# Altium schematic sheet LoRaGN.SchDoc
size 420 x 297 mm; SheetNumber: 1; SheetTotal: 1
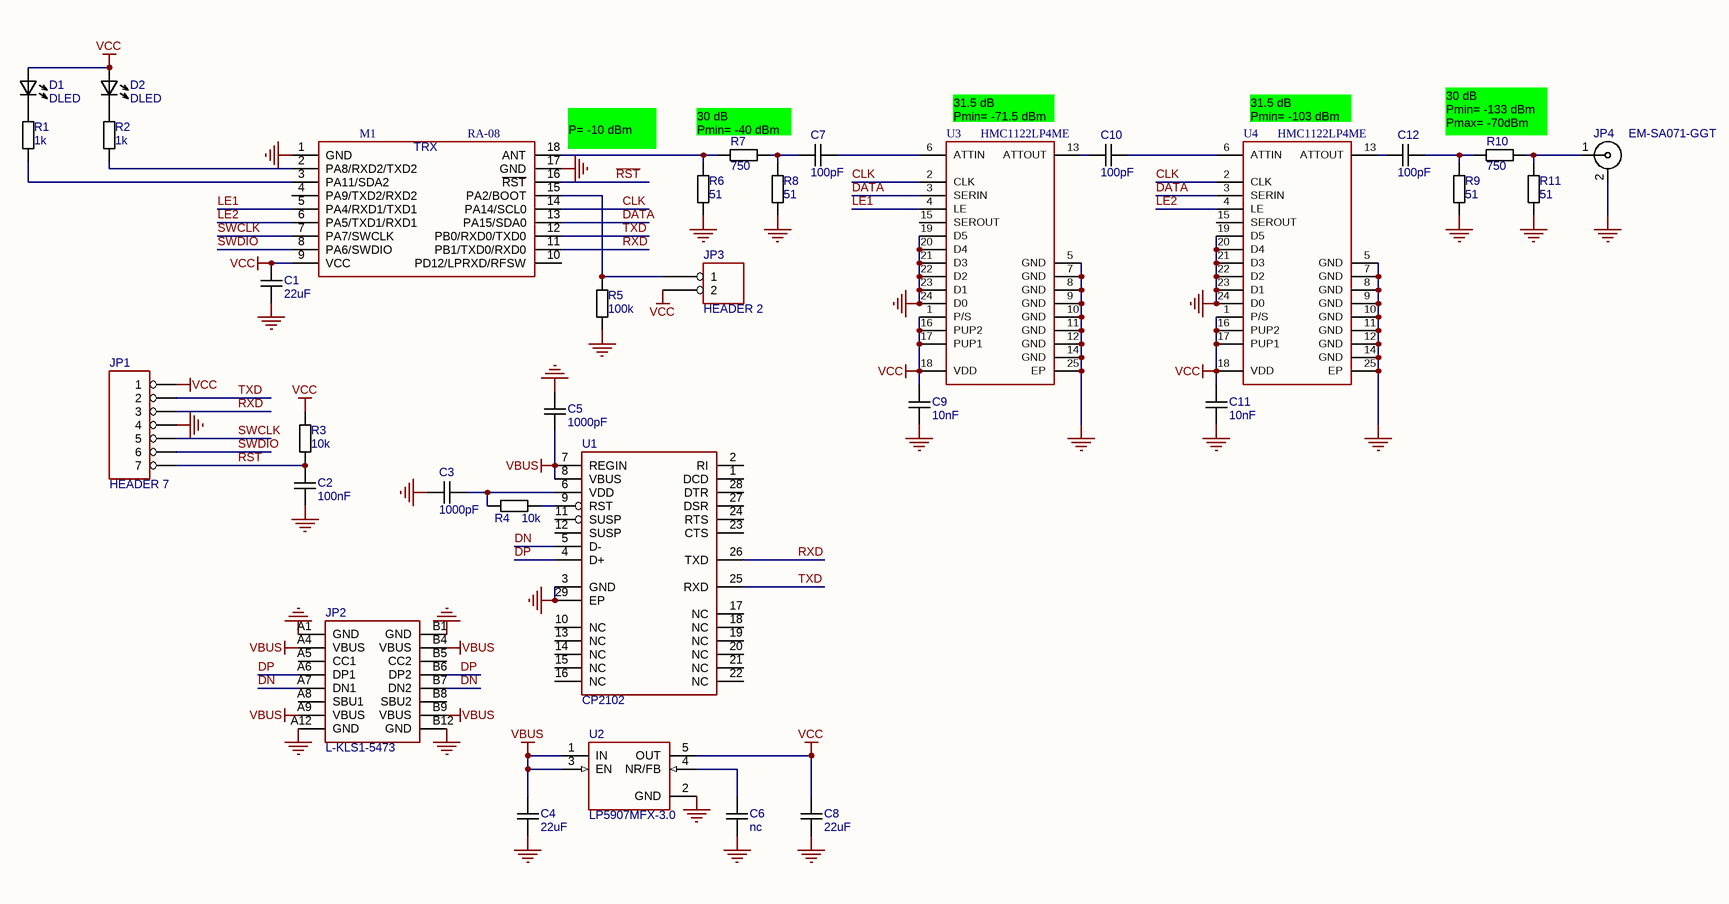
[diagram p0: LoRaGN.SchDoc]

## Parts
C1  22uF  [C-0805]
C2  100nF  [C-0603]
C3  1000pF  [C-0603]
C4  22uF  [C-0805]
C5  1000pF  [C-0603]
C6  nc  [C-0603]
C7  100pF  [C-0603]
C8  22uF  [C-0805]
C9  10nF  [C-0603]
C10  100pF  [C-0603]
C11  10nF  [C-0603]
C12  100pF  [C-0603]
D1  DLED  [LED0805]
D2  DLED  [LED0805]
JP1  HEADER 7  [PLS1-7]
JP2  L-KLS1-5473  [L-KLS1-5473]
JP3  HEADER 2  [PLS1-2]
JP4  EM-SA071-GGT  [SMA_F_EDGE]
M1  RA-08  [LGA18_RA08]
R1  1k  [R-0603]
R2  1k  [R-0603]
R3  10k  [R-0603]
R4  10k  [R-0603]
R5  100k  [R-0603]
R6  51  [R-0603]
R7  750  [R-0603]
R8  51  [R-0603]
R9  51  [R-0603]
R10  750  [R-0603]
R11  51  [R-0603]
U1  CP2102  [QFN28]
U2  LP5907MFX-3.0  [SOT-23-5]
U3  HMC1122LP4ME  [QFN-24(4X4)]
U4  HMC1122LP4ME  [QFN-24(4X4)]

## Nets
GND: C1.1 C2.1 C3.2 C4.2 C5.1 C6.2 C8.2 C9.1 C11.1 JP1.4 JP2.A1(GND) JP2.A12(GND) JP2.B1(GND) JP2.B12(GND) JP4.2 M1.1(GND) M1.17(GND) R5.1 R6.1 R8.1 R9.1 R11.1 U1.3(GND) U1.29(EP) U2.2(GND) U3.5(GND) U3.7(GND) U3.8(GND) U3.9(GND) U3.10(GND) U3.11(GND) U3.12(GND) U3.14(GND) U3.19(D5) U3.20(D4) U3.21(D3) U3.22(D2) U3.23(D1) U3.24(D0) U3.25(EP) U4.5(GND) U4.7(GND) U4.8(GND) U4.9(GND) U4.10(GND) U4.11(GND) U4.12(GND) U4.14(GND) U4.19(D5) U4.20(D4) U4.21(D3) U4.22(D2) U4.23(D1) U4.24(D0) U4.25(EP)
VBUS: C4.1 C5.2 JP2.A4(VBUS) JP2.A9(VBUS) JP2.B4(VBUS) JP2.B9(VBUS) U1.7(REGIN) U1.8(VBUS) U2.1(IN) U2.3(EN)
VCC: C1.2 C8.1 C9.2 C11.2 D1.1 D2.1 JP1.1 JP3.2 M1.9(VCC) R3.2 U2.5(OUT) U3.1(P/S) U3.16(PUP2) U3.17(PUP1) U3.18(VDD) U4.1(P/S) U4.16(PUP2) U4.17(PUP1) U4.18(VDD)
CLK: M1.14(PA14/SCL0) U3.2(CLK) U4.2(CLK)
DATA: M1.13(PA15/SDA0) U3.3(SERIN) U4.3(SERIN)
DN: JP2.A7(DN1) JP2.B7(DN2) U1.5(D-)
DP: JP2.A6(DP1) JP2.B6(DP2) U1.4(D+)
LE1: M1.5(PA4/RXD1/TXD1) U3.4(LE)
LE2: M1.6(PA5/TXD1/RXD1) U4.4(LE)
~{RST}: C2.2 JP1.7 M1.16(~{RST}) R3.1
RXD: JP1.3 M1.11(PB1/TXD0/RXD0) U1.26(TXD)
SWCLK: JP1.5 M1.7(PA7/SWCLK)
SWDIO: JP1.6 M1.8(PA6/SWDIO)
TXD: JP1.2 M1.12(PB0/RXD0/TXD0) U1.25(RXD)
NetC3_1: C3.1 R4.2 U1.6(VDD)
NetC6_1: C6.1 U2.4(NR/FB)
NetC7_1: C7.1 R7.2 R8.2
NetC7_2: C7.2 U3.6(ATTIN)
NetC10_1: C10.1 U3.13(ATTOUT)
NetC10_2: C10.2 U4.6(ATTIN)
NetC12_1: C12.1 U4.13(ATTOUT)
NetC12_2: C12.2 R9.2 R10.1
NetD1_2: D1.2 R1.2
NetD2_2: D2.2 R2.2
NetJP3_1: JP3.1 M1.15(PA2/BOOT) R5.2
NetJP4_1: JP4.1 R10.2 R11.2
NetM1_2: M1.2(PA8/RXD2/TXD2) R2.1
NetM1_3: M1.3(PA11/SDA2) R1.1
NetM1_18: M1.18(ANT) R6.2 R7.1
NetR4_1: R4.1 U1.9(RST)

Not connected (* = marked no-connect by the designer): JP2 17(VSS) A5(CC1) A8(SBU1) B5(CC2) B8(SBU2); M1 4(PA9/TXD2/RXD2) 10(PD12/LPRXD/RFSW); U1 1(DCD) 2(RI) 10(NC) 11(SUSP) 12(SUSP) 13(NC) 14(NC) 15(NC) 16(NC) 17(NC) 18(NC) 19(NC) 20(NC) 21(NC) 22(NC) 23(CTS) 24(RTS) 27(DSR) 28(DTR); U3 15(SEROUT); U4 15(SEROUT)

## Notes on the sheet
- 30 dB
  Pmin= -40 dBm
- (near U3) 31.5 dB
  Pmin= -71.5 dBm
- (near U4) 31.5 dB
  Pmin= -103 dBm
- (near R10) 30 dB
  Pmin= -133 dBm
  Pmax= -70dBm
- P= -10 dBm
- Перв. заст.
- Довідк. №
- Підп. і дата
- Інв. № дубл.
- Зам. інв. №
- Зм.
- Арк.
- № докум.
- Підп.
- Дата
- Літ.
- Маса
- Масштаб
- Т.контр.
- Перев.
- Розроб.
- Аркуш
- Аркушів
- Інв. № ориг.
- Н.контр.
- Затв.
- Копіював
- Формат А3
- (in symbol RA-08) TRX

## Library data of the parts
C1-C12 = CAPN: Voltage: 50V; Точність/група: NP0; Вид: Конденсатор
D1 D2 = DLED: Вид: Світлодіод
JP1 = HEADER 7: Вид: Роз'єм; *: *
JP2 = L-KLS1-5473: Mounting  Method: SMD; Value: *
JP3 = HEADER 2: Вид: Роз'єм; *: *
JP4 = SMA: SMA Female R/A PCB Mount; Вид: Роз'єм
R1-R11 = RES: Точність/група: 5%; Вид: Резистор
U1 = CP2102: Value: {Value}; Mounting  Method: SMD
U2 = LP5907: 250mA Low-Dropout Regulator; Вид: Мікросхема
U3 U4 = HMC1122: Value: HMC8073LP3DE; Вид: Мікросхема